# EAGLE design xlr_pegelwandler_v_1_2 (EAGLE 5.00)
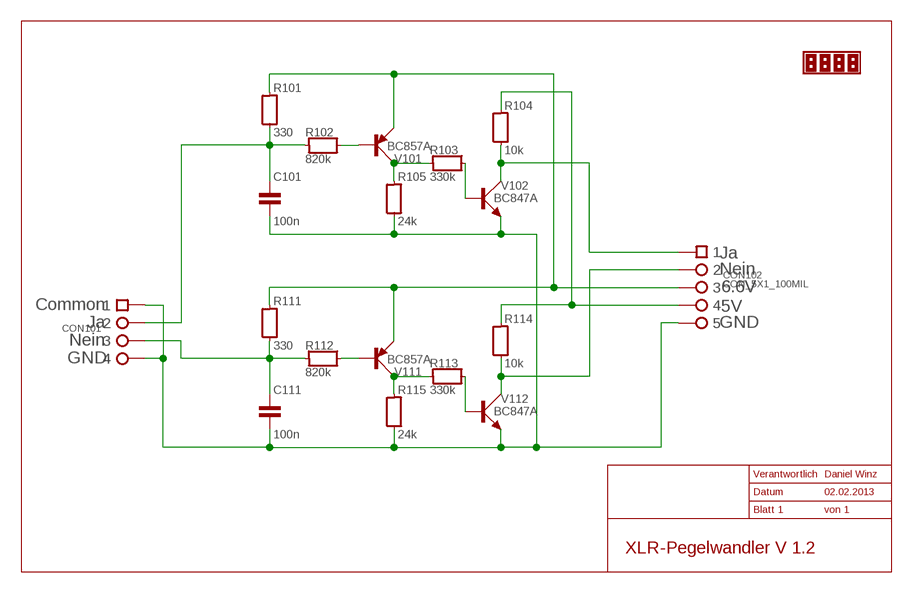
[diagram p0: schematic, sheet 1]

## Parts
C101  100n  KON_V_SMD0805  [C_0805]
C111  100n  KON_V_SMD0805  [C_0805]
CON101  XLR_3P+GXLR_NC3MD-V_NEUTRIK  [XLR_NC3MD-V_NEUTRIK]
CON102  CON_5X1_100MIL  [CON_5X1_100MIL]
R101  330  WID_V_SMD0805  [R_0805]
R102  820k  WID_H_SMD0805  [R_0805]
R103  330k  WID_H_SMD0805  [R_0805]
R104  10k  WID_V_SMD0805  [R_0805]
R105  24k  WID_V_SMD0805  [R_0805]
R111  330  WID_V_SMD0805  [R_0805]
R112  820k  WID_H_SMD0805  [R_0805]
R113  330k  WID_H_SMD0805  [R_0805]
R114  10k  WID_V_SMD0805  [R_0805]
R115  24k  WID_V_SMD0805  [R_0805]
U$1  LP_NUMBER08_SILK_TOP  [LP_NUMBER_SILK_TOP]
V101  BC857A  PNP_VSOT23  [SOT23]
V102  BC847A  NPN_VSOT23  [SOT23]
V111  BC857A  PNP_VSOT23  [SOT23]
V112  BC847A  NPN_VSOT23  [SOT23]

## Nets
CON101: C101.P$1 CON101.2 R101.P$1 R102.P$1
N$2: R103.P$2 V102.1(B)
N$3: R113.P$2 V112.1(B)
N$4: CON102.P$2 R114.P$1 V112.3(C)
N$5: CON102.P$1 R104.P$1 V102.3(C)
N$6: R102.P$2 V101.1(P$B)
N$8: R103.P$1 R105.P$2 V101.3(P$C)
N$9: R113.P$1 R115.P$2 V111.3(P$C)
N$10: CON102.P$3 R101.P$2 R111.P$2 V101.2(P$E) V111.2(P$E)
N$11: R112.P$2 V111.1(P$B)
N$12: C111.P$1 CON101.3 R111.P$1 R112.P$1
N$18: CON102.P$4 R104.P$2 R114.P$2
V102: C101.P$2 C111.P$2 CON101.1 CON101.G CON102.P$5 R105.P$1 R115.P$1 V102.2(E) V112.2(E)

## Notes on the sheet
- Ja
- Nein
- 6.6V
- Common | 5V
- Ja | GND
- Nein
- GND
- Verantwortlich | Daniel Winz
- Datum | 02.02.2013
- Blatt 1 | von 1
- XLR-Pegelwandler V 1.2

## Library data of the parts
C101 C111 = VOW_RCD:KON_V_SMD
CON101 = Winz:XLR_3P+G
CON102 = Winz:CON_5X1_100MIL
R101 R104 R105 R111 R114 R115 = VOW_RCD:WID_V_SMD
R102 R103 R112 R113 = VOW_RCD:WID_H_SMD
U$1 = Platinensammler:LP_NUMBER: Teilnutzenindex Um die einzelnen Teile einer Sammelbestellung schnell und zuverlässig zuordnen zu können, muss jedes Layout eine Markierung erhalten. Da diese Markierung nicht mehr Einfluss auf ein Layout nehmen soll als umbedingt nötig, stellt dieses Device für jede verfügbare Lage einen Plathalter bereit der individuell plaziert werden kann. Rückfragen und oder Anmerkungen bitte an platinensammler@gmail.com
V101 V111 = VOW_TRANSISTOR:PNP_V
V102 V112 = VOW_TRANSISTOR:NPN_V

## Board
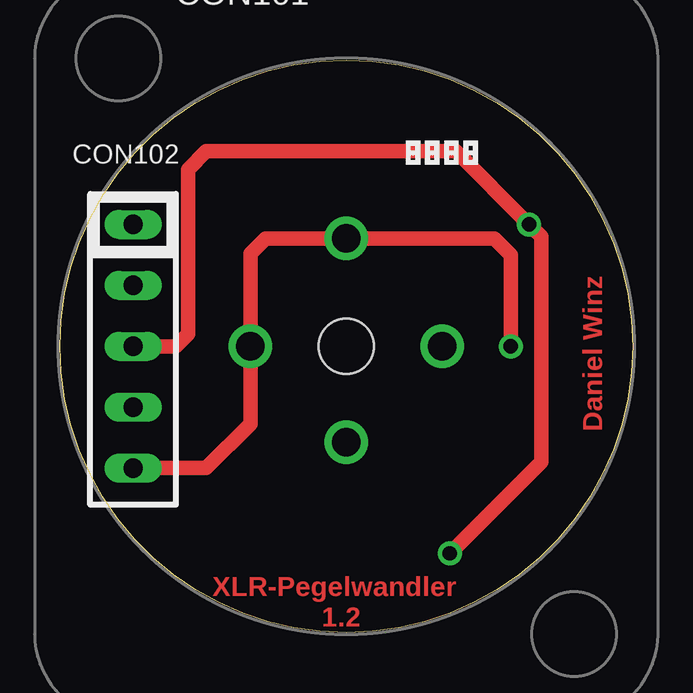
[diagram p1: board, top side]
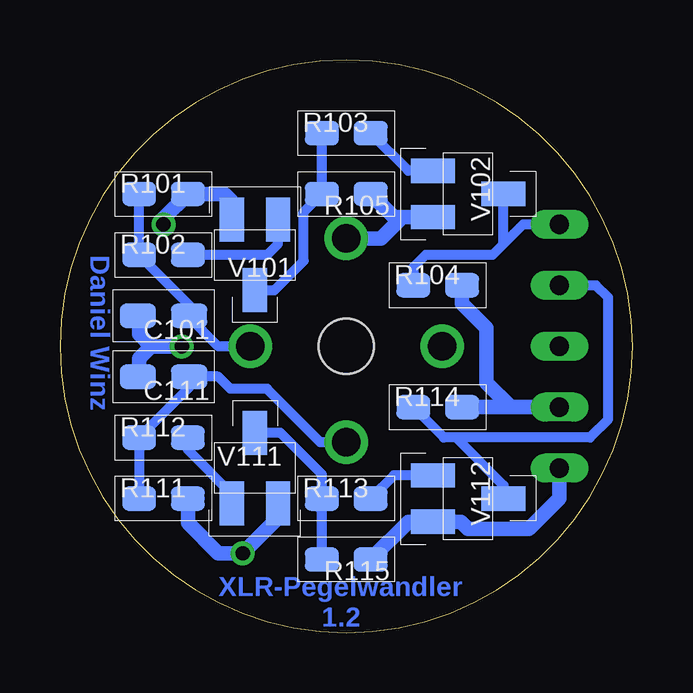
[diagram p2: board, bottom side, seen from below]

Size 23.88 x 23.88 mm. Coordinates in mm from the lower left corner, seen from the top.
Outline: 23.88,11.94 arc-90 11.94,0 arc-90 0,11.94 arc-90 11.94,23.88 arc-90 23.88,11.94
Copper layers (1*16): Top 0.035mm / dielectric 1.5mm / Bottom 0.035mm
Design rules "platinensammler_02 *": minimum track width 0.15mm, minimum drill 0.3mm, track to track 0.15mm, track to pad 0.15mm, pad to pad 0.15mm, via to via 0.15mm, smd to smd 0mil, copper to edge 0.2mm, drill to drill 0.2mm, minimum pad ring 0.2mm, minimum via ring 0.2mm, stop-mask expansion 4mil, vias tented up to drill 0.8mm, thermal gap 0.15mm

### Footprints (pad centres in the part's own frame; a part is rotated, then mirrored left to right if it is on the bottom)
C_0805 = smd 1.524 x 1.016: P$1 -1.067,0; P$2 1.067,0
XLR_NC3MD-V_NEUTRIK = drill 1.2 round: 1 -4,0; 2 4,0; 3 0,-4; G 0,4.5 | hole 2.3: 0,0
CON_5X1_100MIL = drill 0.8 long: P$1 0,5.08; P$2 0,2.54; P$3 0,0; P$4 0,-2.54; P$5 0,-5.08
R_0805 = smd 1.422 x 1.016: P$1 -1.016,0; P$2 1.016,0
SOT23 = smd 1.016 x 1.829: 1 -0.965,-1.473; 2 0.965,-1.473; 3 0,1.473

### Placement (x,y rotation side)
C101  19.56,13.21 180 bottom
C111  19.56,10.67 180 bottom
CON101  11.94,11.94 0 top
CON102  3.05,11.94 0 top
R101  19.56,18.29 0 bottom
R102  19.56,15.75 0 bottom
R103  11.94,20.83 0 bottom
R104  8.13,14.48 0 bottom
R105  11.94,18.29 180 bottom
R111  19.56,5.59 0 bottom
R112  19.56,8.13 0 bottom
R113  11.94,5.59 0 bottom
R114  8.13,9.4 0 bottom
R115  11.94,3.05 180 bottom
U$1  14.22,19.3 0 top
V101  15.75,15.75 180 bottom
V102  6.86,18.29 270 bottom
V111  15.75,6.86 0 bottom
V112  6.86,5.59 270 bottom

### Tracks (layer width: path | path; a pad name or v marks a point on that pad's centre or on a via)
CON101
  Bottom 0.406: CON101.2 17.27,11.94 18.54,13.21 C101.P$1 18.49,13.66 R102.P$1 R101.P$1
N$2
  Bottom 0.406: V102.1 9.35,19.25 R103.P$2
N$3
  Bottom 0.406: V112.1 9.96,6.55 R113.P$2
N$4
  Bottom 0.406: R114.P$1 7.87,8.13 7.37,8.13 | 7.37,8.13 1.78,8.13 1.02,8.89 1.02,13.97 1.52,14.48 CON102.P$2 | V112.3 5.38,6.15 7.37,8.13
N$5
  Bottom 0.406: R104.P$1 9.14,15.24 8.64,15.75 5.84,15.75 5.38,16.21 5.38,16.26 | 5.38,16.26 V102.3 | 5.38,16.26 5.33,16.26 4.57,17.02 CON102.P$1
N$6
  Bottom 0.406: R102.P$2 15.24,15.75 14.78,16.21 V101.1
N$8
  Bottom 0.406: V101.3 14.93,14.28 13.72,15.49 13.72,17.53 R105.P$2 R103.P$1
N$9
  Bottom 0.406: R115.P$2 12.95,5.08 13.21,5.33 R113.P$1 12.95,6.6 14.68,8.33 V111.3
N$10  (via drill 0.6)
  Top 0.61: CON102.P$3 4.83,11.94 5.33,12.45 5.33,19.3 6.1,20.07 16.51,20.07 v19.56,17.02 20.07,16.51 20.07,7.11 v16.26,3.3
  Bottom 0.406: R111.P$2 18.03,5.59
  Bottom 0.61: v19.56,17.02 19.56,17.27 R101.P$2 17.02,18.29 16.71,17.98 V101.2 | V111.2 14.78,4.78 v16.26,3.3 17.27,3.3 18.54,4.57 R111.P$2
N$11
  Bottom 0.406: V111.1 16.71,5.79 18.54,7.62 R112.P$2
N$12
  Bottom 0.406: R111.P$1 R112.P$1 18.49,10.21 C111.P$1 17.27,10.67 16.76,10.16 15.24,10.16 13.02,7.94 CON101.3
N$18
  Bottom 0.61: R104.P$2 7.11,13.72 6.1,12.7 6.1,10.41 5.08,9.4 | CON102.P$4 5.08,9.4 | 5.08,9.4 R114.P$2
V102  (via drill 0.6)
  Top 0.61: CON102.P$5 6.1,6.86 7.94,8.7 CON101.1 7.94,15.81 8.56,16.44 CON101.G 18.11,16.44 18.8,15.75 v18.8,11.94
  Bottom 0.406: 20.57,10.67 C111.P$2 | 20.57,13.21 C101.P$2
  Bottom 0.61: 20.07,11.94 20.57,11.43 20.57,10.67 | v18.8,11.94 20.07,11.94 | 20.07,11.94 20.57,12.45 20.57,13.21 | CON102.P$5 3.05,5.59 4.32,4.32 6.86,4.32 7.16,4.62 V112.2 9.35,4.62 R115.P$1 | CON101.G 10.49,16.44 9.6,17.32 | 9.6,17.32 V102.2 | 9.6,17.32 9.96,17.32 R105.P$1

### Text on the board
Top: Daniel Winz | XLR-Pegelwandler | 1.2
Bottom: Daniel Winz | XLR-Pegelwandler | 1.2